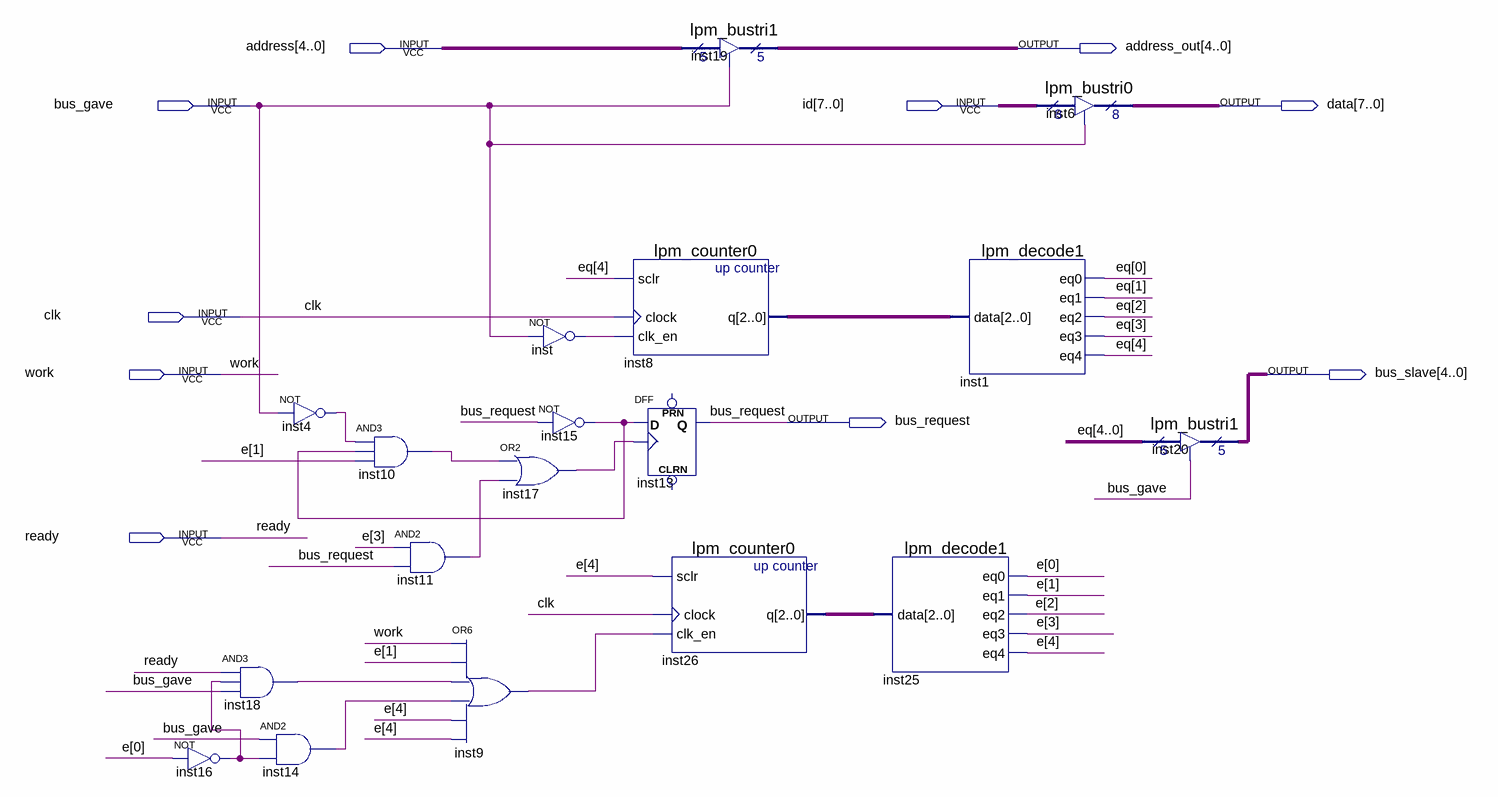
[diagram p0: schematic sheet]
// Quartus schematic bus_master.bdf as structural Verilog: 18 symbols, 10 pins
module bus_master (
  input  [4:0] address,
  input  bus_gave,
  input  [7:0] id,
  input  clk,
  input  work,
  input  ready,
  output [4:0] address_out,
  output [7:0] data,
  output [4:0] bus_slave,
  output bus_request
);

  wire inst4_out, inst9_out, inst10_out, inst11_out, inst14_out, inst15_out, inst16_out, inst17_out,
       inst18_out, inst_out;
  wire [2:0] inst8_q, inst26_q;
  wire [4:0] e, eq;

  not inst16 (inst16_out, e[0]);
  not inst4 (inst4_out, bus_gave);
  and inst18 (inst18_out, ready, inst16_out, bus_gave);
  and inst14 (inst14_out, bus_gave, inst16_out);
  and inst10 (inst10_out, inst4_out, inst15_out, e[1]);
  and inst11 (inst11_out, e[3], bus_request);
  or inst17 (inst17_out, inst10_out, inst11_out);
  or inst9 (inst9_out, work, e[1], inst18_out, inst14_out, e[4], e[4]);
  not inst (inst_out, bus_gave);
  not inst15 (inst15_out, bus_request);
  lpm_counter0 inst8 (.sclr(eq[4]), .clock(clk), .clk_en(inst_out), .q(inst8_q));
  DFF inst13 (.CLK(inst17_out), .D(inst15_out), .Q(bus_request));  // open: CLRN, PRN
  lpm_counter0 inst26 (.sclr(e[4]), .clock(clk), .clk_en(inst9_out), .q(inst26_q));
  lpm_bustri1 inst19 (.enabledt(bus_gave), .data(address), .tridata(address_out));
  lpm_decode1 inst25 (.data(inst26_q), .eq0(e[0]), .eq1(e[1]), .eq2(e[2]), .eq3(e[3]), .eq4(e[4]));
  lpm_decode1 inst1 (.data(inst8_q), .eq0(eq[0]), .eq1(eq[1]), .eq2(eq[2]), .eq3(eq[3]), .eq4(eq[4]));
  lpm_bustri0 inst6 (.enabledt(bus_gave), .data(id), .tridata(data));
  lpm_bustri1 inst20 (.enabledt(bus_gave), .data(eq), .tridata(bus_slave));
endmodule
